# Altium schematic sheet MCU.SchDoc
size A; SheetNumber: 3; SheetTotal: 4
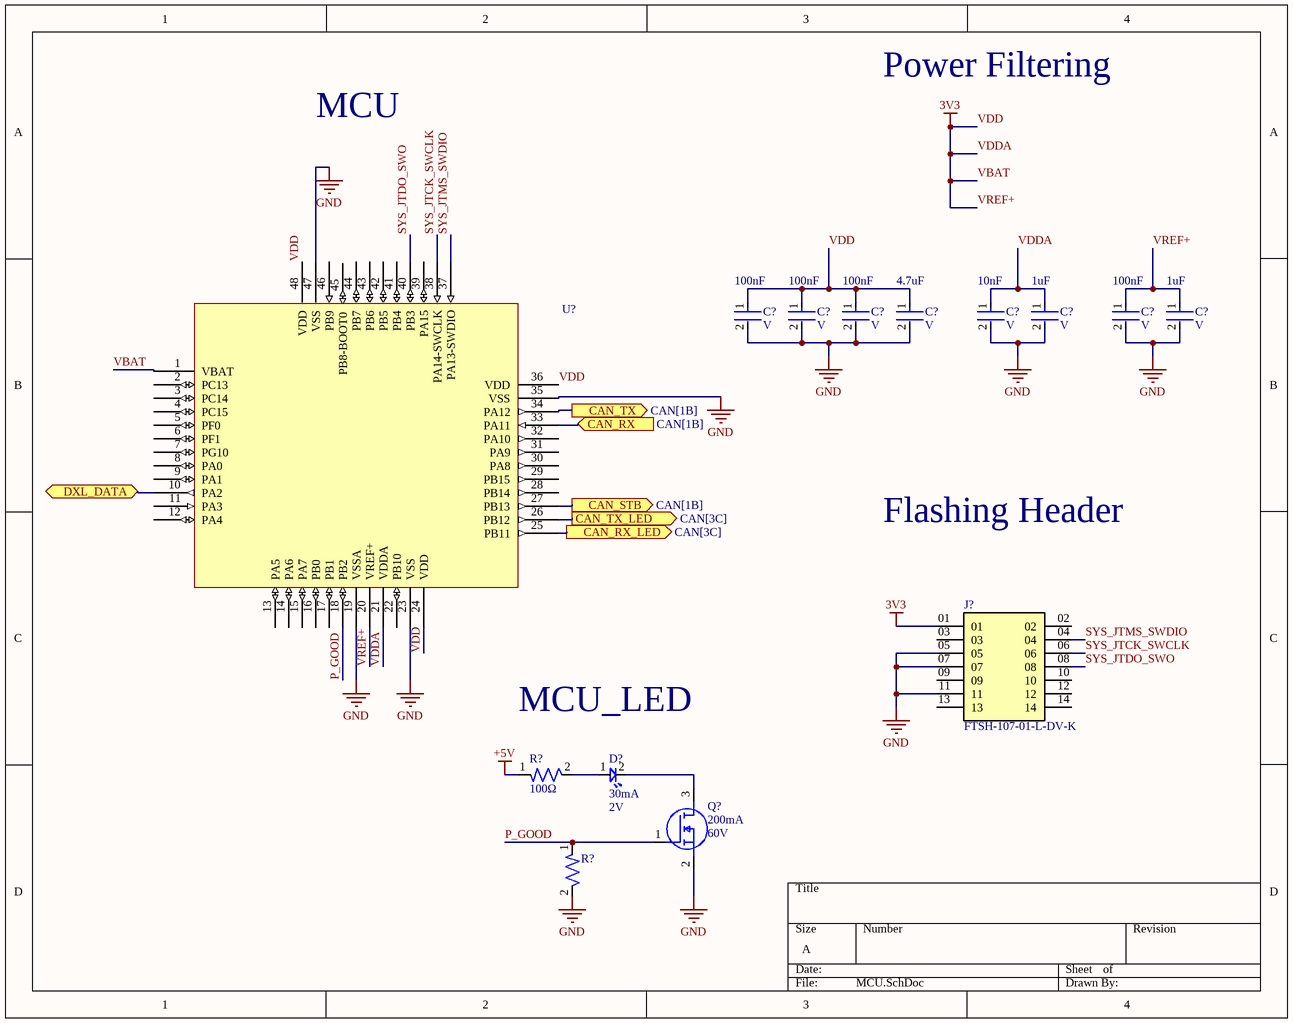
[diagram p0: MCU.SchDoc]

## Parts
(Parts that share a designator on the sheet are numbered #1, #2 ... from top to bottom, then left to right.)
C?#1  Voltage Rating: V  Capacitance: 100nF  [CAP-0603]  (hidden comment: CAP 0603)
C?#2  Voltage Rating: V  Capacitance: 100nF  [CAP-0603]  (hidden comment: CAP 0603)
C?#3  Voltage Rating: V  Capacitance: 100nF  [CAP-0603]  (hidden comment: CAP 0603)
C?#4  Voltage Rating: V  Capacitance: 4.7uF  [CAP-0603]  (hidden comment: CAP 0603)
C?#5  Voltage Rating: V  Capacitance: 10nF  [CAP-0603]  (hidden comment: CAP 0603)
C?#6  Voltage Rating: V  Capacitance: 1uF  [CAP-0603]  (hidden comment: CAP 0603)
C?#7  Voltage Rating: V  Capacitance: 100nF  [CAP-0603]  (hidden comment: CAP 0603)
C?#8  Voltage Rating: V  Capacitance: 1uF  [CAP-0603]  (hidden comment: CAP 0603)
D?  Forward Current: 30mA  Forward Voltage: 2V  [LED-0603]  (hidden comment: BL-HKC36G-AV-TRB)
J?  FTSH-107-01-L-DV-K  [SAMTEC_FTSH-107-01-L-DV-K]
Q?  Continuous Current: 200mA  Voltage: 60V  [IC-SOT23-3]  (hidden comment: T2N7002AK,LM)
R?#1  Resistance: 100Ω  [RES-2010]  (hidden comment: CRF2010-J/-000ELF)
R?#2  CRF2010-J/-000ELF  [RES-2010]  (value not drawn)
U?  STM32G431CBT6  [IC-LQFP48]  (value not drawn)

## Ports
CAN_RX (in, see CAN[1B]), CAN_RX_LED (out, see CAN[3C]), CAN_STB (out, see CAN[1B]), CAN_TX (out, see CAN[1B]), CAN_TX_LED (out, see CAN[3C]), DXL_DATA (bidir)

## Nets
+5V: R?#1.1
GND: C?#1.2 C?#2.2 C?#3.2 C?#4.2 C?#5.2 C?#6.2 C?#7.2 C?#8.2 J?.05 J?.07 J?.11 Q?.2(S) R?#2.2 U?.19(VSSA) U?.23(VSS) U?.35(VSS) U?.47(VSS)
VBAT: C?#1.1 C?#2.1 C?#3.1 C?#4.1 C?#5.1 C?#6.1 C?#7.1 C?#8.1 J?.01 U?.1(VBAT) U?.20(VREF+) U?.21(VDDA) U?.24(VDD) U?.36(VDD) U?.48(VDD)  [also labelled 3V3, VDD, VDDA, VREF+]
CAN_RX: U?.33(PA11) ; port CAN_RX
CAN_RX_LED: U?.25(PB11) ; port CAN_RX_LED
CAN_STB: U?.27(PB13) ; port CAN_STB
CAN_TX: U?.34(PA12) ; port CAN_TX
CAN_TX_LED: U?.26(PB12) ; port CAN_TX_LED
DXL_DATA: U?.10(PA2) ; port DXL_DATA
P_GOOD: Q?.1(G) R?#2.1 U?.18(PB2)
SYS_JTCK_SWCLK: J?.06 U?.38(PA14-SWCLK)
SYS_JTDO_SWO: J?.08 U?.40(PB3)
SYS_JTMS_SWDIO: J?.04 U?.37(PA13-SWDIO)
NetD?_1: D?.1 R?#1.2
NetD?_2: D?.2 Q?.3(D)

Not connected (* = marked no-connect by the designer): J? 02 03 09 10 12 13 14; U? 2(PC13) 3(PC14) 4(PC15) 5(PF0) 6(PF1) 7(PG10) 8(PA0) 9(PA1) 11(PA3) 12(PA4) 13(PA5) 14(PA6) 15(PA7) 16(PB0) 17(PB1) 22(PB10) 28(PB14) 29(PB15) 30(PA8) 31(PA9) 32(PA10) 39(PA15) 41(PB4) 42(PB5) 43(PB6) 44(PB7) 45(PB8-BOOT0) 46(PB9)

## Notes on the sheet
- Power Filtering
- MCU
- Flashing Header
- MCU_LED

## Library data of the parts
D? = LED-0001: LED YELLOW CLEAR 0603 SMD; ComponentLink1Description: Datasheet; ComponentLink1URL: https://www.americanbrightled.com/pdffiles/led-components/smt/BL-HKC36G-AV-TRB.pdf
J? = CONN_Flashing-0001: Connector Header Surface Mount 14 position 0.050" (1.27mm); MF: Samtec; Value: *; Price: None; Package: None; Availability: Unavailable; MP: FTSH-107-01-L-DV-K; ComponentLink1Description: Datasheet; ComponentLink1URL: https://mm.digikey.com/Volume0/opasdata/d220001/medias/docus/6209/ftsh-1xx-xx-xxx-dv-xxx-xxx-x-xx-mkt.pdf
Q? = NMOS-200MA-0001: MOSFET N-CH 60V 200MA SOT23; ComponentLink1Description: Datasheet; ComponentLink1URL: https://toshiba.semicon-storage.com/info/T2N7002AK_datasheet_en_20150401.pdf?did=29712&prodName=T2N7002AK
R?#1 R?#2 = RES-0-0001: 0 Ohms Jumper Chip Resistor 2010 (5025 Metric) Automotive AEC-Q200 Metal Element; Tolerance: 1%; Size: 0402; ComponentLink1Description: Datasheet; ComponentLink1URL: https://www.yageo.com/upload/media/product/products/datasheet/rchip/PYu-RC_Group_51_RoHS_L_12.pdf
U? = IC-STM32G431CBT6: IC MCU 32BIT 128KB FLASH 48LQFP; Package: 48LQFP; ComponentLink1Description: Datasheet; ComponentLink1URL: https://www.st.com/resource/en/datasheet/stm32g431cb.pdf